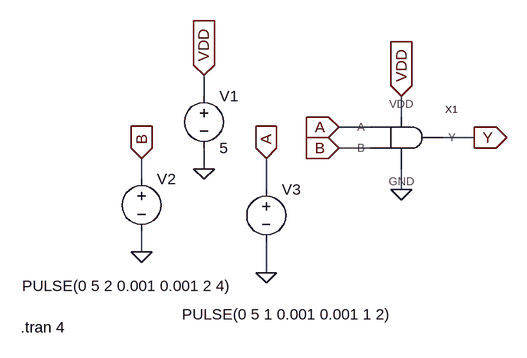
[diagram p0: schematic AND_TEST.asc]
AND_TEST.asc, the LTspice schematic file:
Version 4
SHEET 1 880 680
WIRE 0 96 0 64
WIRE 304 128 304 96
WIRE 256 144 208 144
WIRE 416 160 368 160
WIRE 256 176 208 176
WIRE 0 208 0 176
WIRE -96 224 -96 192
WIRE 96 240 96 192
WIRE 304 240 304 208
WIRE -96 336 -96 304
WIRE 96 368 96 320
FLAG 0 64 VDD
IOPIN 0 64 In
FLAG -96 192 B
IOPIN -96 192 In
FLAG 96 192 A
IOPIN 96 192 In
FLAG 304 96 VDD
IOPIN 304 96 In
FLAG 208 144 A
IOPIN 208 144 In
FLAG 208 176 B
IOPIN 208 176 In
FLAG 416 160 Y
IOPIN 416 160 Out
FLAG 304 240 0
FLAG 0 208 0
FLAG -96 336 0
FLAG 96 368 0
SYMBOL AND 304 160 R0
SYMATTR InstName X1
SYMBOL voltage 0 80 R0
WINDOW 123 0 0 Left 0
WINDOW 39 0 0 Left 0
SYMATTR InstName V1
SYMATTR Value 5
SYMBOL voltage -96 208 R0
WINDOW 3 -184 180 Left 2
WINDOW 123 0 0 Left 0
WINDOW 39 0 0 Left 0
SYMATTR InstName V2
SYMATTR Value PULSE(0 5 2 0.001 0.001 2 4)
SYMBOL voltage 96 224 R0
WINDOW 3 -130 208 Left 2
WINDOW 123 0 0 Left 0
WINDOW 39 0 0 Left 0
SYMATTR InstName V3
SYMATTR Value PULSE(0 5 1 0.001 0.001 1 2)
TEXT -282 452 Left 2 !.tran 4

The netlist it stands for:
* AND_TEST.asc
XX1 VDD 0 A B Y AND  ; pins VDD GND A B Y
V1 VDD 0 5
V2 B 0 PULSE(0 5 2 0.001 0.001 2 4)
V3 A 0 PULSE(0 5 1 0.001 0.001 1 2)
.tran 4
.backanno
.end